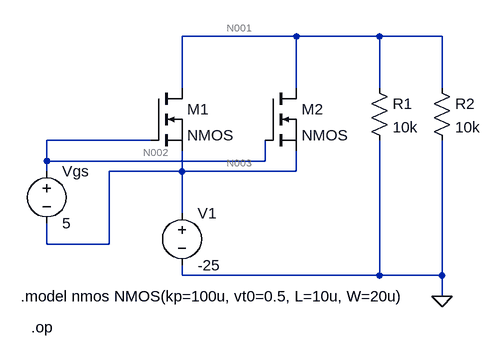
[diagram p0: schematic TASK2.asc]
TASK2.asc, the LTspice schematic file:
Version 4
SHEET 1 880 680
WIRE 400 16 224 16
WIRE 528 16 400 16
WIRE 624 16 528 16
WIRE 224 96 224 16
WIRE 400 96 400 16
WIRE 528 96 528 16
WIRE 624 96 624 16
WIRE 176 176 16 176
WIRE 16 208 16 176
WIRE 352 208 352 176
WIRE 352 208 16 208
WIRE 16 224 16 208
WIRE 224 224 224 192
WIRE 224 224 112 224
WIRE 400 224 400 192
WIRE 400 224 224 224
WIRE 224 288 224 224
WIRE 16 336 16 304
WIRE 112 336 112 224
WIRE 112 336 16 336
WIRE 224 384 224 368
WIRE 528 384 528 176
WIRE 528 384 224 384
WIRE 624 384 624 176
WIRE 624 384 528 384
WIRE 624 416 624 384
FLAG 624 416 0
SYMBOL nmos 176 96 R0
SYMATTR InstName M1
SYMBOL voltage 16 208 R0
SYMATTR InstName Vgs
SYMATTR Value 5
SYMBOL voltage 224 272 R0
WINDOW 123 0 0 Left 0
WINDOW 39 0 0 Left 0
SYMATTR InstName V1
SYMATTR Value -25
SYMBOL res 512 80 R0
SYMATTR InstName R1
SYMATTR Value 10k
SYMBOL res 608 80 R0
SYMATTR InstName R2
SYMATTR Value 10k
SYMBOL nmos 352 96 R0
SYMATTR InstName M2
TEXT -24 416 Left 2 !.model nmos NMOS(kp=100u, vt0=0.5, L=10u, W=20u)
TEXT -8 464 Left 2 !.op

The netlist it stands for:
* TASK2.asc
M1 N001 N002 N003 N003 NMOS
Vgs N002 N003 5
V1 N003 0 -25
R1 N001 0 10k
R2 N001 0 10k
M2 N001 N002 N003 N003 NMOS
.model NMOS NMOS
.model PMOS PMOS
.lib standard.mos
.model nmos NMOS(kp=100u, vt0=0.5, L=10u, W=20u)
.op
.backanno
.end

* Results of the author's LTspice run, read from the files saved beside the schematic
* Operating Point:
*   V(n001) = -20.25 V
*   V(n002) = -20 V
*   V(n003) = -25 V
*   Id(M2) = 2.025 mA
*   Ig(M2) = 0 A
*   Ib(M2) = -4.76 pA
*   Is(M2) = -2.025 mA
*   Id(M1) = 2.025 mA
*   Ig(M1) = 0 A
*   Ib(M1) = -4.76 pA
*   Is(M1) = -2.025 mA
*   I(R2) = -2.025 mA
*   I(R1) = -2.025 mA
*   I(V1) = 4.05 mA
*   I(Vgs) = 0 A
* From the log:
*   Semiconductor Device Operating Points:
*                           --- MOSFET Transistors ---
*   Name:          m2          m1
*   Model:        nmos        nmos
*   Id:          2.03e-03    2.03e-03
*   Vgs:         5.00e+00    5.00e+00
*   Vds:         4.75e+00    4.75e+00
*   Vbs:         0.00e+00    0.00e+00
*   Vth:         5.00e-01    5.00e-01
*   Vdsat:       4.50e+00    4.50e+00
*   Gm:          9.00e-04    9.00e-04
*   Gds:         0.00e+00    0.00e+00
*   Gmb:         0.00e+00    0.00e+00
*   Cbd:         0.00e+00    0.00e+00
*   Cbs:         0.00e+00    0.00e+00
*   Cgsov:       0.00e+00    0.00e+00
*   Cgdov:       0.00e+00    0.00e+00
*   Cgbov:       0.00e+00    0.00e+00
*   Cgs:         0.00e+00    0.00e+00
*   Cgd:         0.00e+00    0.00e+00
*   Cgb:         0.00e+00    0.00e+00